# Altium schematic sheet efm8sb1-dev-board.SchDoc
size Letter; SheetNumber: 1
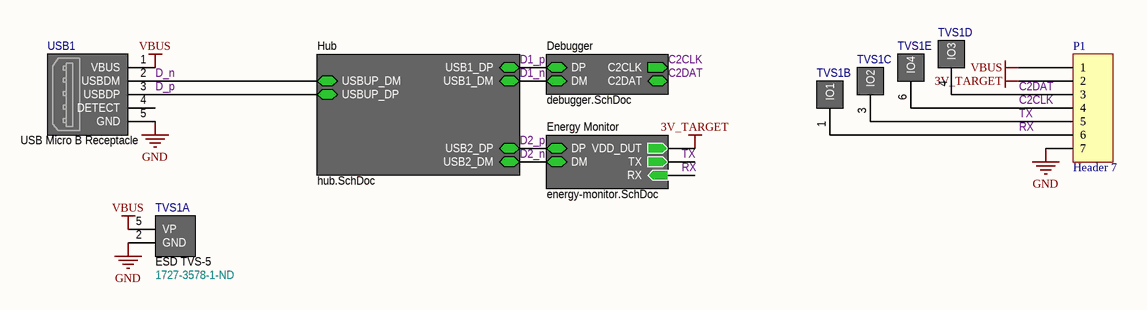
[diagram p0: efm8sb1-dev-board.SchDoc]

## Parts
P1  Header 7  [HDR1X7-PINS]
TVS1  ESD TVS-5  Supplier Part Number 1: 1727-3578-1-ND  [SOT26A-6N]  (parts A,B,C,D,E of 5)
USB1  USB Micro B Receptacle  [10118193-0001LF]

## Sub-sheets
Debugger = debugger.SchDoc: DP (bidir), DM (bidir), C2CLK (out), C2DAT (bidir)
Energy Monitor = energy-monitor.SchDoc: DP (bidir), DM (bidir), TX (out), VDD_DUT (out), RX (in)
Hub = hub.SchDoc: USB1_DP (bidir), USB1_DM (bidir), USB2_DP (bidir), USB2_DM (bidir), USBUP_DP (bidir), USBUP_DM (bidir)

## Nets
3V_TARGET: P1.2 ; sheet Energy Monitor/VDD_DUT
GND: P1.7 TVS1.2(GND) USB1.5(GND)
VBUS: P1.1 TVS1.5(VP) USB1.1(VBUS)
C2CLK: P1.4 TVS1.6(IO4) ; sheet Debugger/C2CLK
C2DAT: P1.3 TVS1.4(IO3) ; sheet Debugger/C2DAT
D1_n: sheet Debugger/DM, sheet Hub/USB1_DM
D1_p: sheet Debugger/DP, sheet Hub/USB1_DP
D2_n: sheet Hub/USB2_DM, sheet Energy Monitor/DM
D2_p: sheet Hub/USB2_DP, sheet Energy Monitor/DP
D_n: USB1.2(USBDM) ; sheet Hub/USBUP_DM
D_p: USB1.3(USBDP) ; sheet Hub/USBUP_DP
RX: P1.6 TVS1.1(IO1) ; sheet Energy Monitor/RX
TX: P1.5 TVS1.3(IO2) ; sheet Energy Monitor/TX

Not connected (* = marked no-connect by the designer): USB1 4(DETECT)

## Library data of the parts
P1 = Header 7: Header, 7-Pin; LatestRevisionDate: 17-Jul-2002; LatestRevisionNote: Re-released for DXP Platform.; Publisher: Altium Limited
TVS1 = ESD TVS-5: 5-channel ESD protection device for USB; Manufacturer Part Number 1: IP4220CZ6,125; Manufacturer Part Number 2: SRV05-4; Supplier 1: Digi-Key